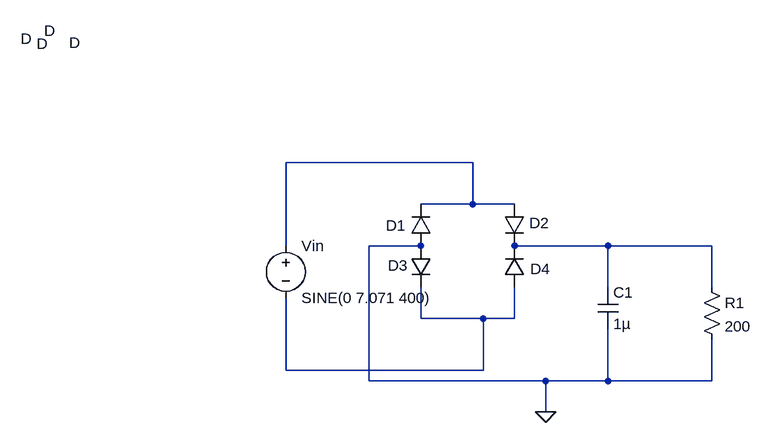
[diagram p0: schematic Draft2.asc]
Draft2.asc, the LTspice schematic file:
Version 4
SHEET 1 880 680
WIRE 304 -16 16 -16
WIRE 304 48 304 -16
WIRE 304 48 224 48
WIRE 368 48 304 48
WIRE 16 112 16 -16
WIRE 224 112 144 112
WIRE 512 112 368 112
WIRE 672 112 512 112
WIRE 512 176 512 112
WIRE 672 176 672 112
WIRE 224 224 224 176
WIRE 320 224 224 224
WIRE 368 224 368 176
WIRE 368 224 320 224
WIRE 16 304 16 192
WIRE 320 304 320 224
WIRE 320 304 16 304
WIRE 144 320 144 112
WIRE 416 320 144 320
WIRE 512 320 512 240
WIRE 512 320 416 320
WIRE 672 320 672 256
WIRE 672 320 512 320
WIRE 416 368 416 320
FLAG 416 368 0
SYMBOL voltage 16 96 R0
WINDOW 123 0 0 Left 0
WINDOW 39 0 0 Left 0
SYMATTR InstName Vin
SYMATTR Value SINE(0 7.071 400)
SYMBOL diode 240 112 R180
WINDOW 0 39 31 Left 2
WINDOW 3 590 311 Left 2
SYMATTR InstName D1
SYMBOL diode 352 48 R0
WINDOW 0 39 29 Left 2
WINDOW 3 -708 -267 Left 2
SYMATTR InstName D2
SYMBOL diode 208 112 R0
WINDOW 0 -35 30 Left 2
WINDOW 3 -600 -319 Left 2
SYMATTR InstName D3
SYMBOL diode 384 176 R180
WINDOW 0 -39 28 Left 2
WINDOW 3 684 377 Left 2
SYMATTR InstName D4
SYMBOL cap 496 176 R0
SYMATTR InstName C1
SYMATTR Value 1µ
SYMBOL res 656 160 R0
SYMATTR InstName R1
SYMATTR Value 200

The netlist it stands for:
* Draft2.asc
Vin N001 N003 SINE(0 7.071 400)
D1 0 N001 D
D2 N001 N002 D
D3 0 N003 D
D4 N003 N002 D
C1 N002 0 1µ
R1 N002 0 200
.model D D
.lib standard.dio
.backanno
.end